# EAGLE design BR81_MKL_3032_Lichtplatine_J0_003_02_01 (EAGLE 5.10)
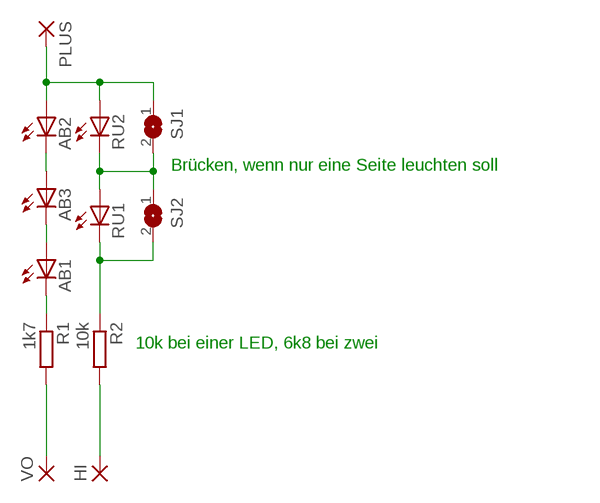
[diagram p0: schematic, sheet 1]

## Parts
AB1  LEDCHIP-LED0603  [CHIP-LED0603]
AB2  LEDCHIP-LED0603  [CHIP-LED0603]
AB3  LEDCHIP-LED0603  [CHIP-LED0603]
HI  SMD2  [SMD1,27-2,54]
PLUS  SMD2  [SMD1,27-2,54]
R1  1k7  R-EU_R0603  [R0603]
R2  10k  R-EU_R0603  [R0603]
RU1  LEDCHIP-LED0603  [CHIP-LED0603]
RU2  LEDCHIP-LED0603  [CHIP-LED0603]
SJ1  SJSS  [SJS]
SJ2  SJSS  [SJS]
VO  SMD2  [SMD1,27-2,54]

## Nets
N$1: AB2.C AB3.A
N$2: R1.2 VO.1(P)
N$3: RU1.A RU2.C SJ1.2 SJ2.1
N$4: AB1.A AB3.C
N$5: AB1.C R1.1
N$6: HI.1(P) R2.2
N$10: AB2.A PLUS.1(P) RU2.A SJ1.1
N$13: R2.1 RU1.C SJ2.2

## Notes on the sheet
- Brücken, wenn nur eine Seite leuchten soll
- 10k bei einer LED, 6k8 bei zwei

## Library data of the parts
AB1-AB3 RU1 RU2 = led:LED: LED OSRAM: - CHIPLED LG R971, LG N971, LY N971, LG Q971, LY Q971, LO R971, LY R971 LH N974, LH R974 LS Q976, LO Q976, LY Q976 LO Q996 - Hyper CHIPLED LW Q18S LB Q993, LB Q99A, LB R99A - SideLED LS A670, LO A670, LY A670, LG A670, LP A670 LB A673, LV A673, LT A673, LW A673 LH A674 LY A675 LS A676, LA A676, LO A676, LY A676, LW A676 LS A679, LY A679, LG A679 - Hyper Micro SIDELED® LS Y876, LA Y876, LO Y876, LY Y876 LT Y87S - SmartLED LW L88C, LW L88S LB L89C, LB L89S, LG L890 LS L89K, LO L89K, LY L89K LS L896, LA L896, LO L896, LY L896 - TOPLED LS T670, LO T670, LY T670, LG T670, LP T670 LSG T670, LSP T670, LSY T670, LOP T670, LYG T670 LG T671, LOG T671, LSG T671 LB T673, LV T673, LT T673, LW T673 LH T674 LS T676, LA T676, LO T676, LY T676, LB T676, LH T676, LSB T676, LW T676 LB T67C, LV T67C, LT T67C, LS T67K, LO T67K, LY T67K, LW E67C LS E67B, LA E67B, LO E67B, LY E67B, LB E67C, LV E67C, LT E67C LW T67C LS T679, LY T679, LG T679 LS T770, LO T770, LY T770, LG T770, LP T770 LB T773, LV T773, LT T773, LW T773 LH T774 LS E675, LA E675, LY E675, LS T675 LS T776, LA T776, LO T776, LY T776, LB T776 LHGB T686 LT T68C, LB T68C - Hyper Mini TOPLED® LB M676 - Mini TOPLED Santana® LG M470 LS M47K, LO M47K, LY M47K Source: http://www.osram.convergy.de LUXEON: - LUMILED® LXK2-PW12-R00, LXK2-PW12-S00, LXK2-PW14-U00, LXK2-PW14-V00 LXK2-PM12-R00, LXK2-PM12-S00, LXK2-PM14-U00 LXK2-PE12-Q00, LXK2-PE12-R00, LXK2-PE12-S00, LXK2-PE14-T00, LXK2-PE14-U00 LXK2-PB12-K00, LXK2-PB12-L00, LXK2-PB12-M00, LXK2-PB14-N00, LXK2-PB14-P00, LXK2-PB14-Q00 LXK2-PR12-L00, LXK2-PR12-M00, LXK2-PR14-Q00, LXK2-PR14-R00 LXK2-PD12-Q00, LXK2-PD12-R00, LXK2-PD12-S00 LXK2-PH12-R00, LXK2-PH12-S00 LXK2-PL12-P00, LXK2-PL12-Q00, LXK2-PL12-R00 Source: www.luxeon.com KINGBRIGHT: KA-3528ASYC Source: www.kingbright.com
HI PLUS VO = wirepad:SMD2: SMD PAD
R1 R2 = rcl:R-EU_: RESISTOR, European symbol
SJ1 SJ2 = jumper:SJS

## Board
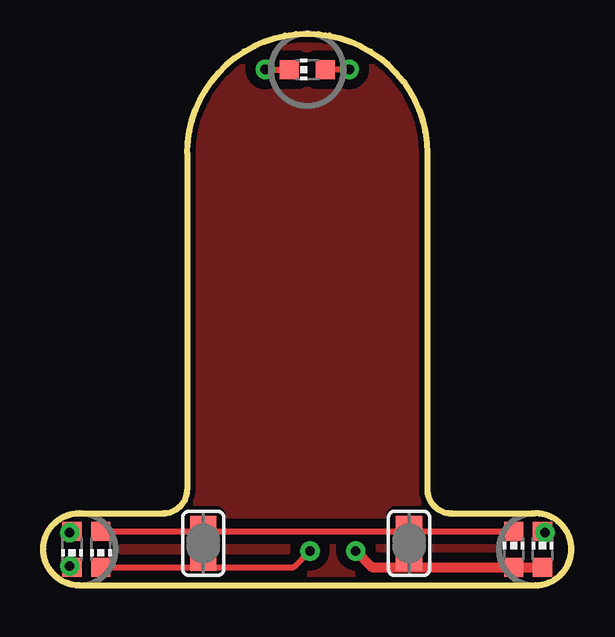
[diagram p1: board, top side]
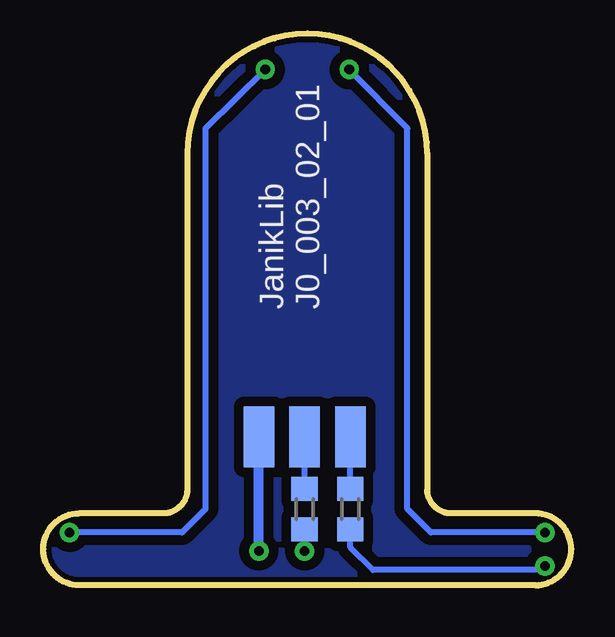
[diagram p2: board, bottom side, seen from below]

No outline drawn. Coordinates in mm, seen from the top.
Copper layers (1*16): Top 0.035mm / dielectric 1.5mm / Bottom 0.035mm
Design rules "default *": minimum track width 7mil, minimum drill 0.6mm, track to track 8mil, track to pad 8mil, pad to pad 8mil, via to via 8mil, smd to smd 8mil, copper to edge 40mil, drill to drill 8mil, minimum pad ring 10mil, minimum via ring 8mil, stop-mask expansion 4mil, vias tented up to drill 0mil, thermal gap 10mil
Milling: 13 lines

### Footprints (pad centres in the part's own frame; a part is rotated, then mirrored left to right if it is on the bottom)
CHIP-LED0603 = smd 0.8 x 0.8: A 0,-0.75; C 0,0.75
SMD1,27-2,54 = smd 1.27 x 2.54: 1 0,0
R0603@1 = smd 1 x 1.1: 1 -0.85,0; 2 0.85,0
SJS = smd 1 x 1.1: 1 -0.65,0; 2 0.65,0

### Placement (x,y rotation side)
AB1  1.2,1.5 180 top
AB2  20.8,1.5 0 top
AB3  11,21.5 90 top
HI  11.11,6.19 180 bottom
PLUS  13.02,6.19 180 bottom
R1  1k7  [R0603@1]  9.21,3.17 90 bottom
R2  10k  [R0603@1]  11.11,3.17 90 bottom
RU1  2.4,1.5 180 top
RU2  19.6,1.5 0 top
SJ1  15.24,1.75 90 top
SJ2  6.67,1.75 270 top
VO  9.21,6.19 180 bottom

### Tracks (layer width: path | path; a pad name or v marks a point on that pad's centre or on a via)
N$1  (via drill 0.4)
  Top 0.254: AB2.C 20.85,2.25 v20.9,2.2 | v12.75,21.5 AB3.A
  Bottom 0.254: v20.9,2.2 16.21,2.2 15.24,3.17 15.24,19.05 v12.75,21.5
N$2
  Bottom 0.254: R1.2 VO.1
N$3
  Top 0.254: RU1.A 6.67,2.25 | 6.67,2.25 15.24,2.25 | 15.24,2.25 RU2.C | 6.67,2.25 SJ2.1 | 15.24,2.25 SJ1.2
N$4  (via drill 0.4)
  Top 0.254: AB1.A 1.14,2.25 1.1,2.21 v1.1,2.2 | v9.25,21.5 AB3.C
  Bottom 0.254: v1.1,2.2 5.85,2.2 6.83,3.17 6.83,19.05 v9.25,21.5
N$5  (via drill 0.4)
  Top 0.254: AB1.C 1.15,0.75 v1.1,0.8
  Bottom 0.254: v1.1,0.8 1.26,0.64 8.26,0.64 9.21,1.59 R1.1
N$6
  Bottom 0.254: R2.2 HI.1 | HI.1
N$7
  pour Top (isolate 0.406): 1.5,2.5 arc90 0.5,1.5 arc90
  pour Bottom (isolate 0.406): 1.5,2.5 arc90 0.5,1.5 arc90
N$8
  pour Bottom (isolate 0.406): 15.5,18 arc90 11,22.5 arc90 6.5,18 6.5,4 arc-90 5,2.5 1.5,2.5 arc90 0.5,1.5 arc90 1.5,0.5 20.5,0.5 arc90 21.5,1.5 arc90 20.5,2.5 17,2.5 arc-90 15.5,4
  pour Top (isolate 0.406): 15.5,18 arc90 11,22.5 arc90 6.5,18 6.5,4 arc-90 5,2.5 1.5,2.5 arc90 0.5,1.5 arc90 1.5,0.5 20.5,0.5 arc90 21.5,1.5 arc90 20.5,2.5 17,2.5 arc-90 15.5,4
N$10  (via drill 0.4)
  Top 0.254: AB2.A 20.95,0.91 20.95,0.95 | 15.24,0.75 SJ1.1
  Top 0.406: AB2.A RU2.A 15.24,0.75 13.7,0.75 v13.02,1.43
  Bottom 0.406: v13.02,1.43 PLUS.1
N$13  (via drill 0.4)
  Top 0.254: RU1.C 6.67,0.75 | 6.67,0.75 10.43,0.75 v11.11,1.43 | SJ2.2 | 6.67,0.75 SJ2.2
  Bottom 0.254: v11.11,1.43 R2.1 | R2.1

### Text on the board
bNames: J0_003_02_01 | JanikLib
tStop: BR81 LED | Für Märklin 3032(1) | design by Janik Merz
bStop: vo | hi | +